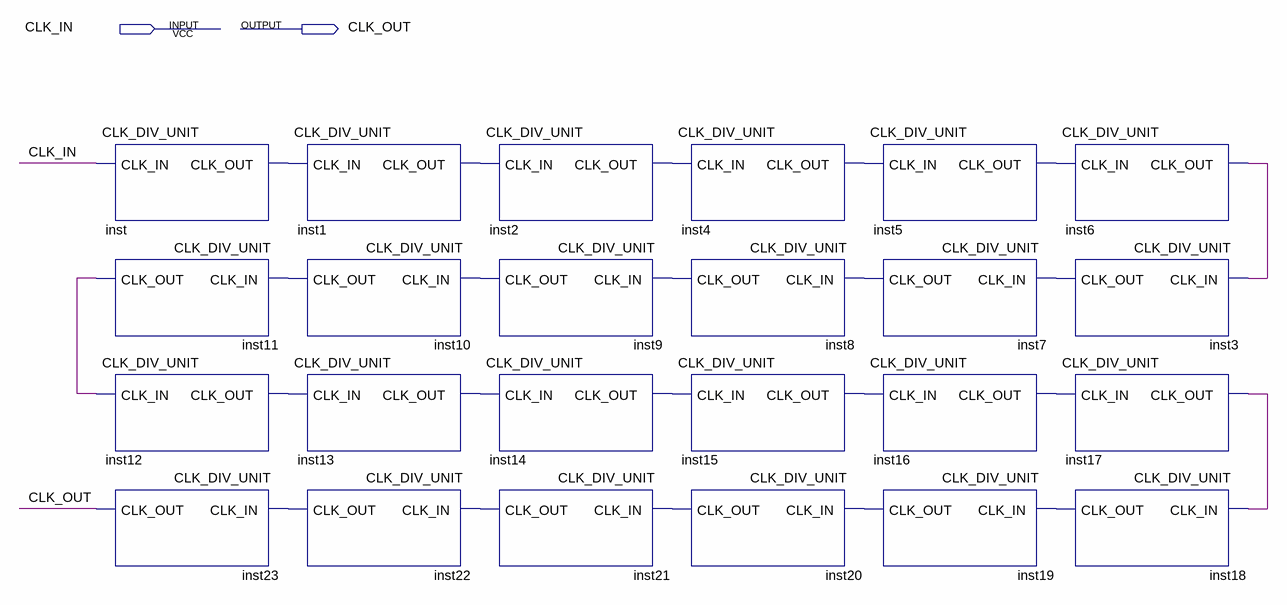
[diagram p0: schematic sheet]
// Quartus schematic CLK_DIV.bdf as structural Verilog: 24 symbols, 2 pins
module CLK_DIV (
  input  CLK_IN,
  output CLK_OUT
);

  wire inst1_clk_out, inst2_clk_out, inst3_clk_out, inst4_clk_out, inst5_clk_out, inst6_clk_out,
       inst7_clk_out, inst8_clk_out, inst9_clk_out, inst10_clk_out, inst11_clk_out, inst12_clk_out,
       inst13_clk_out, inst14_clk_out, inst15_clk_out, inst16_clk_out, inst17_clk_out, inst18_clk_out,
       inst19_clk_out, inst20_clk_out, inst21_clk_out, inst22_clk_out, inst_clk_out;

  CLK_DIV_UNIT inst (.CLK_IN(CLK_IN), .CLK_OUT(inst_clk_out));
  CLK_DIV_UNIT inst11 (.CLK_IN(inst10_clk_out), .CLK_OUT(inst11_clk_out));
  CLK_DIV_UNIT inst12 (.CLK_IN(inst11_clk_out), .CLK_OUT(inst12_clk_out));
  CLK_DIV_UNIT inst23 (.CLK_IN(inst22_clk_out), .CLK_OUT(CLK_OUT));
  CLK_DIV_UNIT inst1 (.CLK_IN(inst_clk_out), .CLK_OUT(inst1_clk_out));
  CLK_DIV_UNIT inst10 (.CLK_IN(inst9_clk_out), .CLK_OUT(inst10_clk_out));
  CLK_DIV_UNIT inst13 (.CLK_IN(inst12_clk_out), .CLK_OUT(inst13_clk_out));
  CLK_DIV_UNIT inst22 (.CLK_IN(inst21_clk_out), .CLK_OUT(inst22_clk_out));
  CLK_DIV_UNIT inst2 (.CLK_IN(inst1_clk_out), .CLK_OUT(inst2_clk_out));
  CLK_DIV_UNIT inst9 (.CLK_IN(inst8_clk_out), .CLK_OUT(inst9_clk_out));
  CLK_DIV_UNIT inst14 (.CLK_IN(inst13_clk_out), .CLK_OUT(inst14_clk_out));
  CLK_DIV_UNIT inst21 (.CLK_IN(inst20_clk_out), .CLK_OUT(inst21_clk_out));
  CLK_DIV_UNIT inst4 (.CLK_IN(inst2_clk_out), .CLK_OUT(inst4_clk_out));
  CLK_DIV_UNIT inst8 (.CLK_IN(inst7_clk_out), .CLK_OUT(inst8_clk_out));
  CLK_DIV_UNIT inst15 (.CLK_IN(inst14_clk_out), .CLK_OUT(inst15_clk_out));
  CLK_DIV_UNIT inst20 (.CLK_IN(inst19_clk_out), .CLK_OUT(inst20_clk_out));
  CLK_DIV_UNIT inst5 (.CLK_IN(inst4_clk_out), .CLK_OUT(inst5_clk_out));
  CLK_DIV_UNIT inst7 (.CLK_IN(inst3_clk_out), .CLK_OUT(inst7_clk_out));
  CLK_DIV_UNIT inst16 (.CLK_IN(inst15_clk_out), .CLK_OUT(inst16_clk_out));
  CLK_DIV_UNIT inst19 (.CLK_IN(inst18_clk_out), .CLK_OUT(inst19_clk_out));
  CLK_DIV_UNIT inst6 (.CLK_IN(inst5_clk_out), .CLK_OUT(inst6_clk_out));
  CLK_DIV_UNIT inst3 (.CLK_IN(inst6_clk_out), .CLK_OUT(inst3_clk_out));
  CLK_DIV_UNIT inst17 (.CLK_IN(inst16_clk_out), .CLK_OUT(inst17_clk_out));
  CLK_DIV_UNIT inst18 (.CLK_IN(inst17_clk_out), .CLK_OUT(inst18_clk_out));
endmodule
